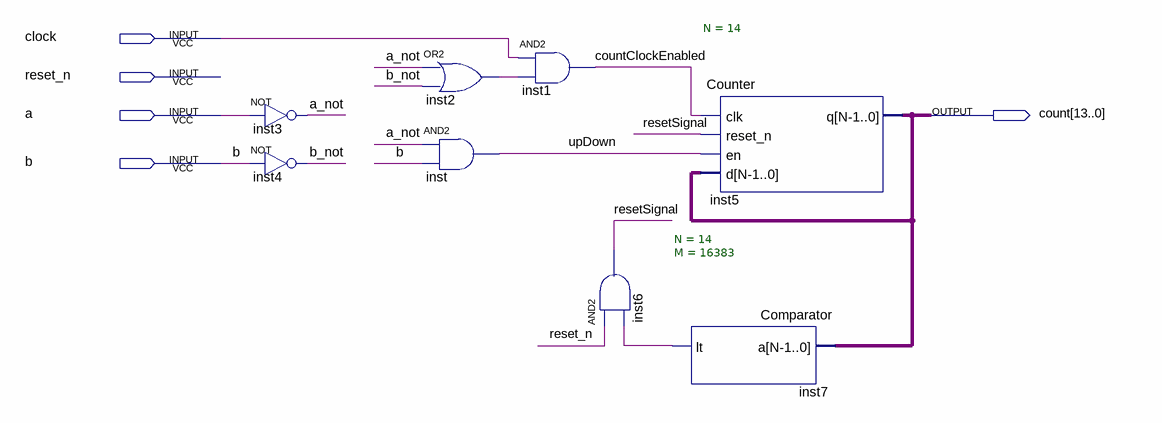
[diagram p0: schematic sheet]
// Quartus schematic ArrowLogicCounter.bdf as structural Verilog: 8 symbols, 5 pins
module ArrowLogicCounter (
  input  clock,
  input  reset_n,
  input  a,
  input  b,
  output [13:0] count
);

  wire a_not, b_not, countClockEnabled, inst2_out, inst7_lt, resetSignal, upDown;

  not inst3 (a_not, a);
  not inst4 (b_not, b);
  or inst2 (inst2_out, a_not, b_not);
  and inst (upDown, a_not, b);
  and inst1 (countClockEnabled, clock, inst2_out);
  and inst6 (resetSignal, reset_n, inst7_lt);
  Counter #(.N(14)) inst5 (.clk(countClockEnabled), .reset_n(resetSignal), .en(upDown), .d(count), .q(count));
  Comparator #(.N(14), .M(16383)) inst7 (.a(count), .lt(inst7_lt));
endmodule
